# EAGLE schematic phase (EAGLE 9.1.2)
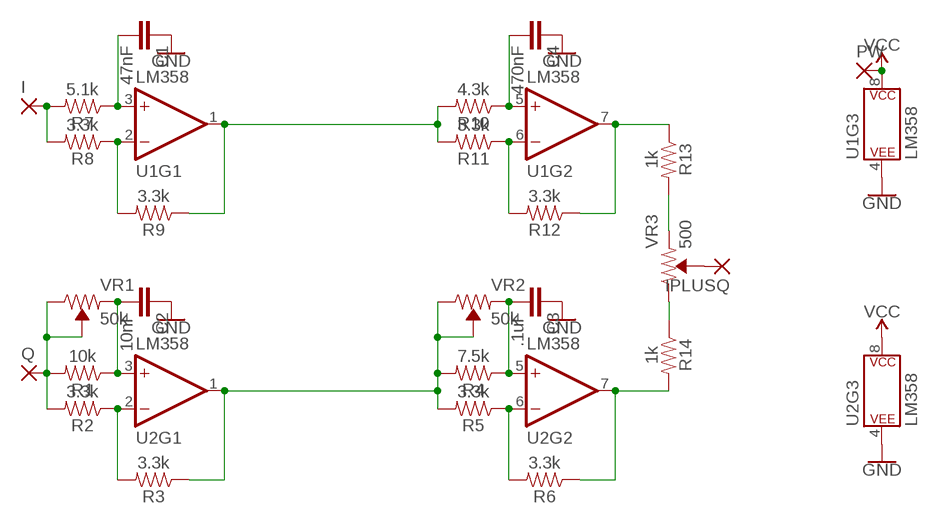
[diagram p0: schematic, sheet 1]

## Parts
C1  47nF  C5/3.5  [C5B3.5]
C2  10nF  C5/3.5  [C5B3.5]
C3  .1uF  C5/3.5  [C5B3.5]
C4  470nF  C5/3.5  [C5B3.5]
I  2,54/1,1  [2,54/1,1]
IPLUSQ  2,54/1,1  [2,54/1,1]
PW  2,54/1,1  [2,54/1,1]
Q  2,54/1,1  [2,54/1,1]
R1  10k  1KOHM-HORIZ-1/4W-1%  [AXIAL-0.3]
R2  3.3k  1KOHM-HORIZ-1/4W-1%  [AXIAL-0.3]
R3  3.3k  1KOHM-HORIZ-1/4W-1%  [AXIAL-0.3]
R4  7.5k  1KOHM-HORIZ-1/4W-1%  [AXIAL-0.3]
R5  3.3k  1KOHM-HORIZ-1/4W-1%  [AXIAL-0.3]
R6  3.3k  1KOHM-HORIZ-1/4W-1%  [AXIAL-0.3]
R7  5.1k  1KOHM-HORIZ-1/4W-1%  [AXIAL-0.3]
R8  3.3k  1KOHM-HORIZ-1/4W-1%  [AXIAL-0.3]
R9  3.3k  1KOHM-HORIZ-1/4W-1%  [AXIAL-0.3]
R10  4.3k  1KOHM-HORIZ-1/4W-1%  [AXIAL-0.3]
R11  3.3k  1KOHM-HORIZ-1/4W-1%  [AXIAL-0.3]
R12  3.3k  1KOHM-HORIZ-1/4W-1%  [AXIAL-0.3]
R13  1k  1KOHM-HORIZ-1/4W-1%  [AXIAL-0.3]
R14  1k  1KOHM-HORIZ-1/4W-1%  [AXIAL-0.3]
U1  LM358  [DIP08]
U2  LM358  [DIP08]
VR1  50k  TRIMPOT-PTH-10MM-KNOB-1/2W-10%  [TRIMPOT-PTH-3386U]
VR2  50k  TRIMPOT-PTH-10MM-KNOB-1/2W-10%  [TRIMPOT-PTH-3386U]
VR3  500  TRIMPOT-PTH-10MM-KNOB-1/2W-10%  [TRIMPOT-PTH-3386U]

## Nets
GND: C1.1 C2.1 C3.1 C4.1 U1.4(P$V-) U2.4(P$V-)
N$1: C2.2 R1.P$1 U2.3(+IN) VR1.1(CCW)
N$2: R2.P$1 R3.P$2 U2.2(-IN)
N$3: R3.P$1 R4.P$2 R5.P$2 U2.1(OUT) VR2.2(WIPER) VR2.3(CW)
N$4: Q.1(P) R1.P$2 R2.P$2 VR1.2(WIPER) VR1.3(CW)
N$5: C3.2 R4.P$1 U2.5(+IN) VR2.1(CCW)
N$6: R5.P$1 R6.P$2 U2.6(-IN)
N$7: R8.P$1 R9.P$2 U1.2(-IN)
N$8: R6.P$1 R14.P$2 U2.7(OUT)
N$9: C1.2 R7.P$1 U1.3(+IN)
N$10: I.1(P) R7.P$2 R8.P$2
N$11: C4.2 R10.P$1 U1.5(+IN)
N$12: R9.P$1 R10.P$2 R11.P$2 U1.1(OUT)
N$13: R11.P$1 R12.P$2 U1.6(-IN)
N$14: R13.P$2 VR3.1(CCW)
N$15: R12.P$1 R13.P$1 U1.7(OUT)
N$16: R14.P$1 VR3.3(CW)
N$17: IPLUSQ.1(P) VR3.2(WIPER)
VCC: PW.1(P) U1.8(P$V+) U2.8(P$V+)

## Library data of the parts
C1-C4 = capacitor-wima:C: CAPACITOR naming: grid - package width
I IPLUSQ PW Q = wirepad:2,54/1,1: THROUGH-HOLE PAD
R1-R12 = SparkFun-Resistors:1KOHM: 1kΩ resistor A resistor is a passive two-terminal electrical component that implements electrical resistance as a circuit element. Resistors act to reduce current flow, and, at the same time, act to lower voltage levels within circuits. - Wikipedia; PROD_ID: RES-12182; VALUE: 1k
R13 R14 = SparkFun-Resistors:1KOHM: 1kΩ resistor A resistor is a passive two-terminal electrical component that implements electrical resistance as a circuit element. Resistors act to reduce current flow, and, at the same time, act to lower voltage levels within circuits. - Wikipedia; PROD_ID: RES-12182
U1 U2 = SparkFun-IC-Amplifiers:LM358: LM358 Jellybean op-amp Datasheet <http://www.sparkfun.com/datasheets/Components/General/LM358.pdf> SparkFun Products Op-Amp (Thru-Hole) - LM358 <https://www.sparkfun.com/products/9456> (COM-09456); PROD_ID: IC-09172
VR1-VR3 = SparkFun-Resistors:TRIMPOT: Trimming Potentiometer (Trimpot) Three-terminal potentiometers, with an adjustable wiper and two adjustable resistors. A pot can be used to create a configurable voltage divider, or as a variable resistor. "Trimpots" are a subset of potentiometers, usually intended for "set-and-forget" applications. They're often more delicate than standard potentiometers - rated for fewer turns. Variants PTH-KNOB - PTH Trimpot w/ finger-adjustable knob Trimpot 10K with Knob <https://www.sparkfun.com/products/9806> (COM-09806) Datasheet <http://www.sparkfun.com/datasheets/Components/General/TSR-3386.pdf> SMD-3MM-CLOSED-FRAME - SMD 3mm Square Closed-Frame Trimpot Used on e.g. EasyDriver - Stepper Motor Driver <https://www.sparkfun.com/products/12779> Datasheet <http://www.bitechnologies.com/pdfs/22.pdf> (22AR10KTR) SMD-5MM - SMD 5mm Square Closed-Frame Trimpot Used on e.g. IOIO-OTG - V2.2 <https://www.sparkfun.com/products/13613> Datasheet <http://www.vishay.com/docs/51008/ts53.pdf> (TS53YL502MR10) SMD-3MM-1/10W-25% - 3mm Square Open-Frame Trimpot Used on e.g. SparkFun Shapeoko <https://www.sparkfun.com/products/13899> Datasheet <http://www.bourns.com/docs/Product-Datasheets/TC33.pdf> (TC33X-2-103E); PROD_ID: RES-09730; SF_SKU: COM-09806; VALUE: 10k

## Net classes
0 default: width 0.762 mm, drill 0.762 mm, clearance 0.762 mm